# EAGLE schematic untitled (EAGLE 8.3.1)
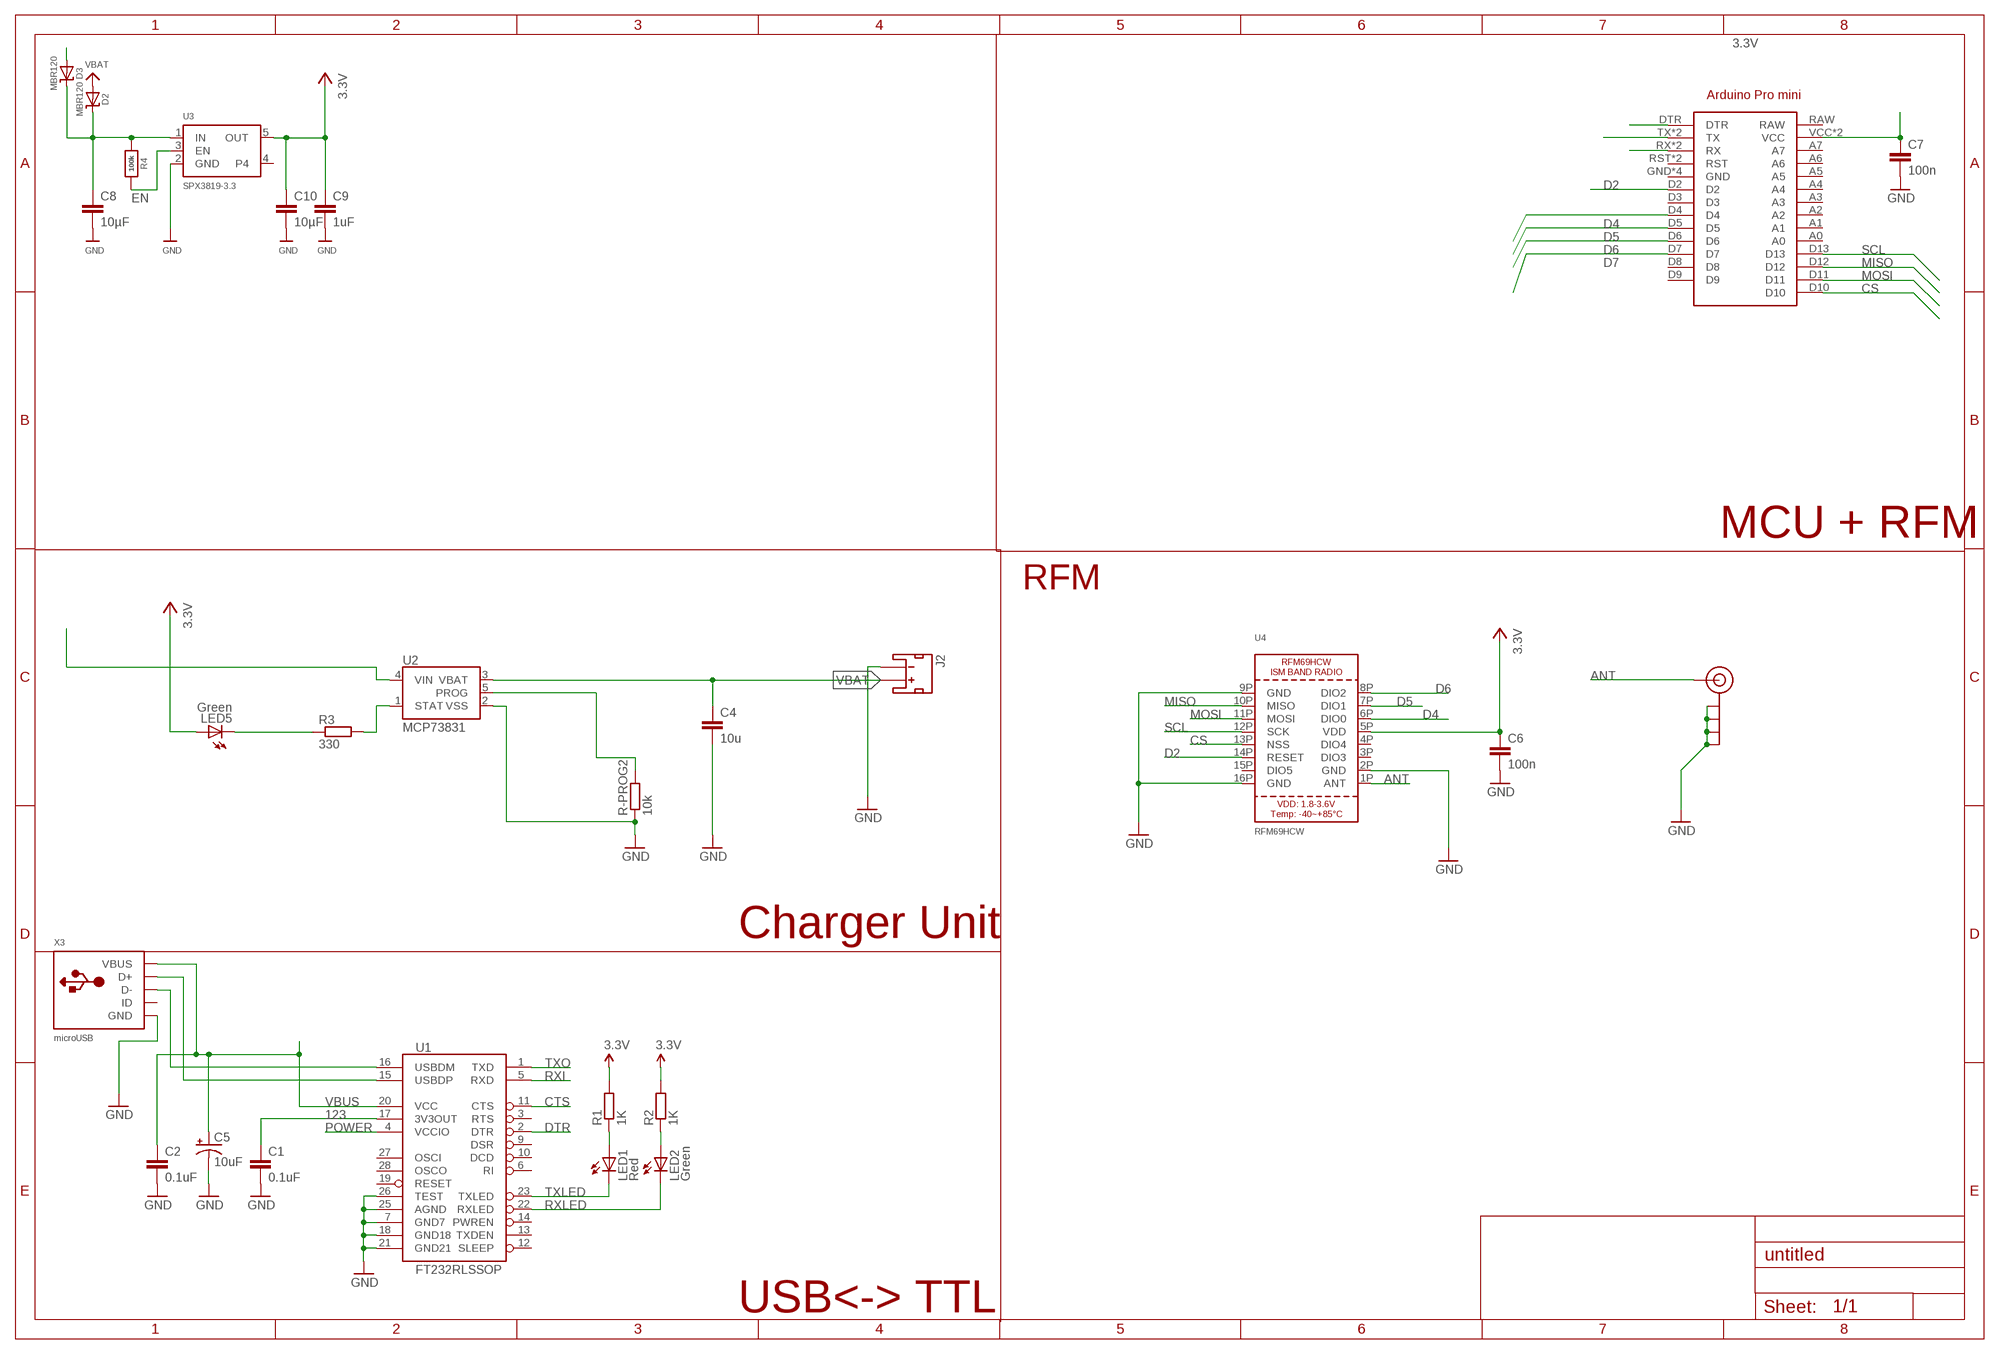
[diagram p0: schematic, sheet 1]

## Parts
C1  0.1uF  C-EUC0805  [C0805]
C2  0.1uF  C-EUC0805  [C0805]
C4  10u  C-EUC0805  [C0805]
C5  10uF  CAP_POL1206  [EIA3216]
C6  100n  C-EUC0805  [C0805]
C7  100n  C-EUC0805  [C0805]
C8  10µF  C-EUC0805  [C0805]
C9  1uF  C-EUC0805  [C0805]
C10  10µF  C-EUC0805  [C0805]
D2  MBR120  DIODE-SCHOTTKYSOD-123  [SOD-123]
D3  MBR120  DIODE-SCHOTTKYSOD-123  [SOD-123]
J2  JST_2MM_MALE  [JST-2-SMD]
J$2  ANTENNATINY  [SMA_UFL_PAD_TINY]
LED1  Red  LED0603  [LED-0603]
LED2  Green  LED0603  [LED-0603]
LED5  Green  LED0603  [LED-0603]
R1  1K  R-EU_R0805  [R0805]
R2  1K  R-EU_R0805  [R0805]
R3  330  R-EU_R0805  [R0805]
R4  100k  RESISTOR_0603_NOOUT  [0603-NO]
R-PROG2  10k  R-EU_R0805  [R0805]
U1  FT232RLSSOP  [SSOP28DB]
U2  MCP73831  [SOT23-5]
U3  SPX3819-3.3  VREG_SOT23-5  [SOT23-5]
U4  RFM69HCW  RFM69HCW_SMT  [RFMHCW_SMT]
U$1  ARDUINO_PRO_MINI  [ARDUINO_PRO_MINI]
X3  microUSB  USB_MICRO_20329_V2  [4UCONN_20329_V2]

## Nets
3.3V [power]: C6.1 C7.1 C9.1 C10.1 LED5.A R1.2 R2.2 U3.5(OUT) U4.5P(VDD) U$1.VCC U$1.VCC@1(VCC)
123 [power]: C1.1 U1.17(3V3OUT)
ANT: J$2.ANT1(SIGNAL) J$2.ANT2(SIGNAL) J$2.ANT3(SIGNAL) U4.1P(ANT)
CS: U4.13P(NSS) U$1.D10
CTS: U1.11(CTS)
D2: U4.14P(RESET) U$1.D2
D4: U4.6P(DIO0) U$1.D4
D5: U4.7P(DIO1) U$1.D5
D6: U4.8P(DIO2) U$1.D6
D7: U$1.D7
DTR: U1.2(DTR) U$1.DTR
EN: R4.2 U3.3(EN)
GND: C1.2 C2.2 C4.2 C5.C(-) C6.2 C7.2 C8.2 C9.2 C10.2 J2.1(-) J$2.GND1(GND) J$2.GND2(GND) J$2.GND3(GND) J$2.GND4(GND) R-PROG2.1 U1.7(GND7) U1.18(GND18) U1.21(GND21) U1.25(AGND) U1.26(TEST) U2.2(VSS) U3.2(GND) U4.2P(GND) U4.9P(GND) U4.16P(GND) X3.BASE@1(GND) X3.BASE@2(GND) X3.GND X3.SPRT@1(GND) X3.SPRT@2(GND) X3.SPRT@3(GND) X3.SPRT@4(GND)
LOL: R-PROG2.2 U2.5(PROG)
MISO: U4.10P(MISO) U$1.D12
MOSI: U4.11P(MOSI) U$1.D11
N$1: LED1.A R1.1
N$2: LED2.A R2.1
N$5: LED5.C R3.1
N$6: R3.2 U2.1(STAT)
POWER: U1.4(VCCIO)
RXI: U1.5(RXD) U$1.TX U$1.TX@1(TX)
RXLED: LED2.C U1.22(RXLED)
SCL: U4.12P(SCK) U$1.D13
TXLED: LED1.C U1.23(TXLED)
TXO: U1.1(TXD) U$1.RX U$1.RX@1(RX)
USB_D+: U1.15(USBDP) X3.D+
USB_D-: U1.16(USBDM) X3.D-
V5: C8.1 D2.C D3.C R4.1 U2.4(VIN) U3.1(IN)
VBAT: C4.1 D2.A J2.2(+) U2.3(VBAT)
VBUS: C2.1 C5.A(+) D3.A U1.20(VCC) X3.VBUS
Unconnected: J2.NC1(PAD1) J2.NC2(PAD2) U1.3(RTS) U1.6(RI) U1.9(DSR) U1.10(DCD) U1.12(SLEEP) U1.13(TXDEN) U1.14(PWREN) U1.19(RESET) U1.27(OSCI) U1.28(OSCO) U3.4 U4.3P(DIO3) U4.4P(DIO4) U4.15P(DIO5) U$1.A0 U$1.A1 U$1.A2 U$1.A3 U$1.A4 U$1.A5 U$1.A6 U$1.A7 U$1.D3 U$1.D8 U$1.D9 U$1.RAW U$1.RST U$1.RST@1(RST) X3.ID

## Notes on the sheet
- MCU + RFM
- RFM
- Charger Unit
- USB<-> TTL

## Power pins joined to a net without a drawn wire
GND: U$1.GND U$1.GND@1(GND) U$1.GND@2(GND) U$1.GND@3(GND)

## Library data of the parts
C1 C2 C4 C6-C10 = rcl:C-EU: CAPACITOR, European symbol
C5 = SparkFun:CAP_POL: Capacitor Polarized These are standard SMD and PTH capacitors. Normally 10uF, 47uF, and 100uF in electrolytic and tantalum varieties. Always verify the external diameter of the through hole cap, it varies with capacity, voltage, and manufacturer. The EIA devices should be standard.
D2 D3 = microbuilder:DIODE-SCHOTTKY
J2 = SparkFun-Connectors:JST_2MM_MALE: Mates to single-cell LiPo batteries. CONN-08352; PROD_ID: CONN-08352
J$2 = _c2h:ANTENNA: SMA Antenna Connector End launch SMA connector. The paste layer has been removed so that the connector can be hand soldered onto the board after reflow.
LED1 LED2 LED5 = SparkFun:LED: LEDs Standard schematic elements and footprints for 5mm, 3mm, 1206, and 0603 sized LEDs. 5mm - Spark Fun Electronics SKU : COM-00529 (and others)
R1-R3 R-PROG2 = rcl:R-EU_: RESISTOR, European symbol
R4 = microbuilder:RESISTOR: Resistors For new designs, use the packages preceded by an '_' character since they are more reliable: The following footprints should be used on most boards: _0402 - Standard footprint for regular board layouts _0603 - Standard footprint for regular board layouts _0805 - Standard footprint for regular board layouts _1206 - Standard footprint for regular board layouts For extremely tight-pitch boards where space is at a premium, the following 'micro-pitch' footprints can be used (smaller pads, no silkscreen outline, etc.): _0402MP - Micro-pitch footprint for very dense/compact boards _0603MP - Micro-pitch footprint for very dense/compact boards _0805MP - Micro-pitch footprint for very dense/compact boards _1206MP - Micro-pitch footprint for very dense/compact boards
U1 = SparkFun:FT232RL: USB UART FT232RL 4th Generation USB UART (USB <-> Serial) Controller. Spark Fun Electronics SKU : COM-00650
U2 = SparkFun-PowerIC:MCP73831: Miniature single cell, fully integrated Li-Ion, Li-polymer charge management controller http://ww1.microchip.com/downloads/en/DeviceDoc/21984a.pdf IC-09995; PROD_ID: IC-09995
U3 = microbuilder:VREG_SOT23-5: SOT23-5 Fixed Voltage Regulators Part Current Out V Out V In V Dropout θJA (°C/W) TJ (°C) Digikey Part No. ADP121 150mA 3.3V 3.4-5.5V 0.09V @ 150mA -- -- ADP121-AUJZ33R7CT-ND ADP121 150mA 3.0V 3.1-5.5V 0.09V @ 150mA -- -- ADP121-AUJZ30R7CT-ND ADP122 300mA 3.3V 3.4-5.5V 0.085V @ 300mA -- -- ADP122AUJZ-3.3-R7CT-ND ADP1712 300mA 3.3V 3.5-5.5V 0.17V @ 300mA -- -- ADP1712AUJZ-3.3-R7TR-ND AP7311 (Low Cost) 150mA 3.3V 3.5-6V 0.15V @ 150mA -- -- AP7311-33WG-7DICT-ND LD39015M18R 150mA 1.8V 1.9V-5.5V 0.08V @ 100mA -- -- 497-6977-1-ND LP2985A-33DBVR 150mA 3.3V 3.3-16V 0.28V @ 150mA 206 150 296-18479-1-ND MCP1824T-3302E/OT 300mA 3.3V 3.5V-6V 0.2V @ 300mA -- -- MCP1824T-3302E/OTCT-ND MIC5205-2.5YM5 TR 150mA 2.5V 2.7-16V 0.165V @ 150mA -- -- 576-1257-2-ND MIC5205-3.0YM5 TR 150mA 3.0V 3.2V-16V 0.165V @ 150mA -- -- 576-1258-2-ND MIC5205-3.3YM5 TR 150mA 3.3V 3.5V-16V 0.165V @ 150mA -- -- 576-1259-2-ND TPS780330220 150mA 3.3V+2.2V 3.6-5.5V 250mV Max -- -- 296-23332-1-ND TDA3663/N1,135 100mA 3.3V 3.5-45V 0.18V @ 50mA -- -- 568-5343-1-ND Max operating temp can be calculated using θJA, TJ (max junction temperature), and power in watts. Set the "Maximum Ambient Temperature" until it reaches TJ ("Max Junction Temperature"), which is the absolute limit for safe use of the regulator: Heat Sink Temperature Calculator <http://www.daycounter.com/Calculators/Heat-Sink-Temperature-Calculator.phtml> For example, With 12V source into a 3.3V LP2985 and a 30mA load, we are dissipating (12V-3.3V) * 0.03A = 0.261W. With a θJA of 206 °C/W, a TJ of 150°C, and 261mW we can safely use the chip without a heat sink up to 75°C (=147.1°C Junction Temperature).
U4 = microbuilder:RFM69HCW: RFM69HCW - ISM Band RF Transceiver
U$1 = arduinopromini:ARDUINO_PRO_MINI: For creating Arduino Pro Mini shields
X3 = microbuilder:USB: USB Connectors USBMINIB - Surface Mount Female Mini-B USB Connector 4UConnector: 06564

## Net classes
0 default: width 0.254 mm, drill 0.6 mm, clearance 0.254 mm
1 power: width 0.406 mm, drill 0.6 mm, clearance 0.205 mm to class 0, clearance 0.254 mm